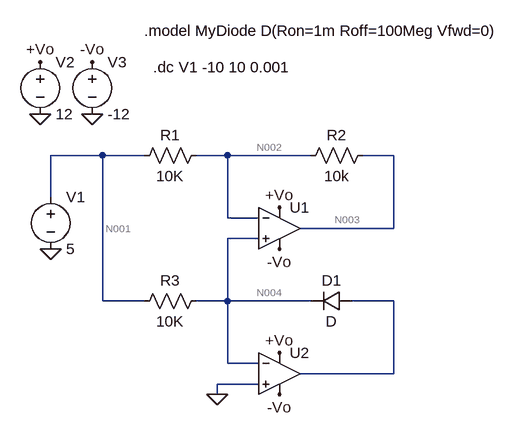
[diagram p0: schematic lab3_3.asc]
lab3_3.asc, the LTspice schematic file:
Version 4
SHEET 1 1064 680
WIRE 64 112 -16 112
WIRE 128 112 64 112
WIRE 256 112 208 112
WIRE 384 112 256 112
WIRE 512 112 464 112
WIRE -16 176 -16 112
WIRE 256 208 256 112
WIRE 304 208 256 208
WIRE 512 224 512 112
WIRE 512 224 368 224
WIRE 304 240 256 240
WIRE 64 336 64 112
WIRE 128 336 64 336
WIRE 256 336 256 240
WIRE 256 336 208 336
WIRE 384 336 256 336
WIRE 512 336 448 336
WIRE 256 432 256 336
WIRE 304 432 256 432
WIRE 512 448 512 336
WIRE 512 448 368 448
WIRE 304 464 240 464
WIRE 240 480 240 464
FLAG -16 256 0
FLAG 240 480 0
FLAG 48 -32 -Vo
FLAG 336 480 -Vo
FLAG 336 256 -Vo
FLAG -32 -32 +Vo
FLAG 336 416 +Vo
FLAG 336 192 +Vo
FLAG -32 48 0
FLAG 48 48 0
SYMBOL voltage -16 160 R0
WINDOW 123 0 0 Left 0
WINDOW 39 0 0 Left 0
SYMATTR InstName V1
SYMATTR Value 5
SYMBOL voltage -32 -48 R0
WINDOW 123 0 0 Left 0
WINDOW 39 0 0 Left 0
SYMATTR InstName V2
SYMATTR Value 12
SYMBOL voltage 48 -48 R0
WINDOW 123 0 0 Left 0
WINDOW 39 0 0 Left 0
SYMATTR InstName V3
SYMATTR Value -12
SYMBOL res 224 96 R90
WINDOW 0 0 56 VBottom 2
WINDOW 3 32 56 VTop 2
SYMATTR InstName R1
SYMATTR Value 10K
SYMBOL res 480 96 R90
WINDOW 0 0 56 VBottom 2
WINDOW 3 32 56 VTop 2
SYMATTR InstName R2
SYMATTR Value 10k
SYMBOL res 224 320 R90
WINDOW 0 0 56 VBottom 2
WINDOW 3 32 56 VTop 2
SYMATTR InstName R3
SYMATTR Value 10K
SYMBOL diode 448 320 R90
WINDOW 0 0 32 VBottom 2
WINDOW 3 32 32 VTop 2
SYMATTR InstName D1
SYMBOL Opamps\\UniversalOpamp2 336 224 R0
SYMATTR InstName U1
SYMBOL Opamps\\UniversalOpamp2 336 448 R0
SYMATTR InstName U2
TEXT 128 -80 Left 2 !.model MyDiode D(Ron=1m Roff=100Meg Vfwd=0)
TEXT 142 -24 Left 2 !.dc V1 -10 10 0.001

The netlist it stands for:
* lab3_3.asc
V1 N001 0 5
V2 +Vo 0 12
V3 -Vo 0 -12
R1 N002 N001 10K
R2 N003 N002 10k
R3 N004 N001 10K
D1 N005 N004 D
XU1 N004 N002 +Vo -Vo N003 level.2 Avol=1Meg GBW=10Meg Slew=10Meg ilimit=25m rail=0 Vos=0 phimargin=45 en=0 enk=0 in=0 ink=0 Rin=500Meg  ; pins IN+ IN- V+ V- OUT
XU2 0 N004 +Vo -Vo N005 level.2 Avol=1Meg GBW=10Meg Slew=10Meg ilimit=25m rail=0 Vos=0 phimargin=45 en=0 enk=0 in=0 ink=0 Rin=500Meg  ; pins IN+ IN- V+ V- OUT
.model D D
.lib standard.dio
.model MyDiode D(Ron=1m Roff=100Meg Vfwd=0)
.dc V1 -10 10 0.001
.lib UniversalOpamps2.sub
.backanno
.end

* Results of the author's LTspice run, read from the files saved beside the schematic
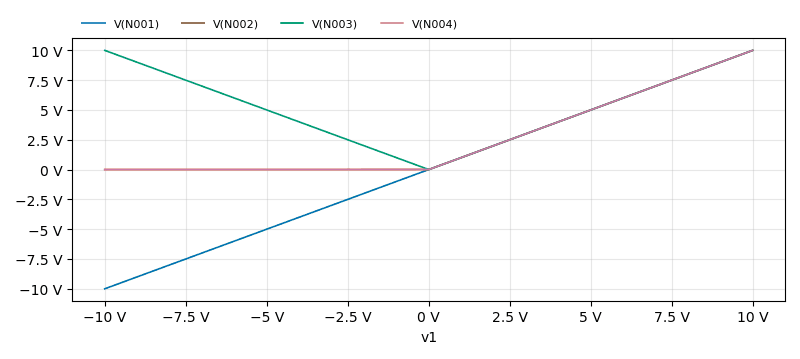
[diagram p1: DC transfer characteristic of lab3_3.asc, plotted from the saved traces]
* DC transfer characteristic, 1 run:
*   V(N001): -10 V at v1=-10 V, 10 V at v1=10 V, min -10 V, max 10 V
*   V(N002): -10.71 µV at v1=-10 V, 10 V at v1=10 V, min -10.71 µV, max 10 V
*   V(N003): 10 V at v1=-10 V, 9.999 V at v1=10 V, min -99.85 fV, max 10 V
*   V(N004): -665.7 nV at v1=-10 V, 10 V at v1=10 V, min -665.7 nV, max 10 V